# Altium project PCB_Project1.PrjPCB
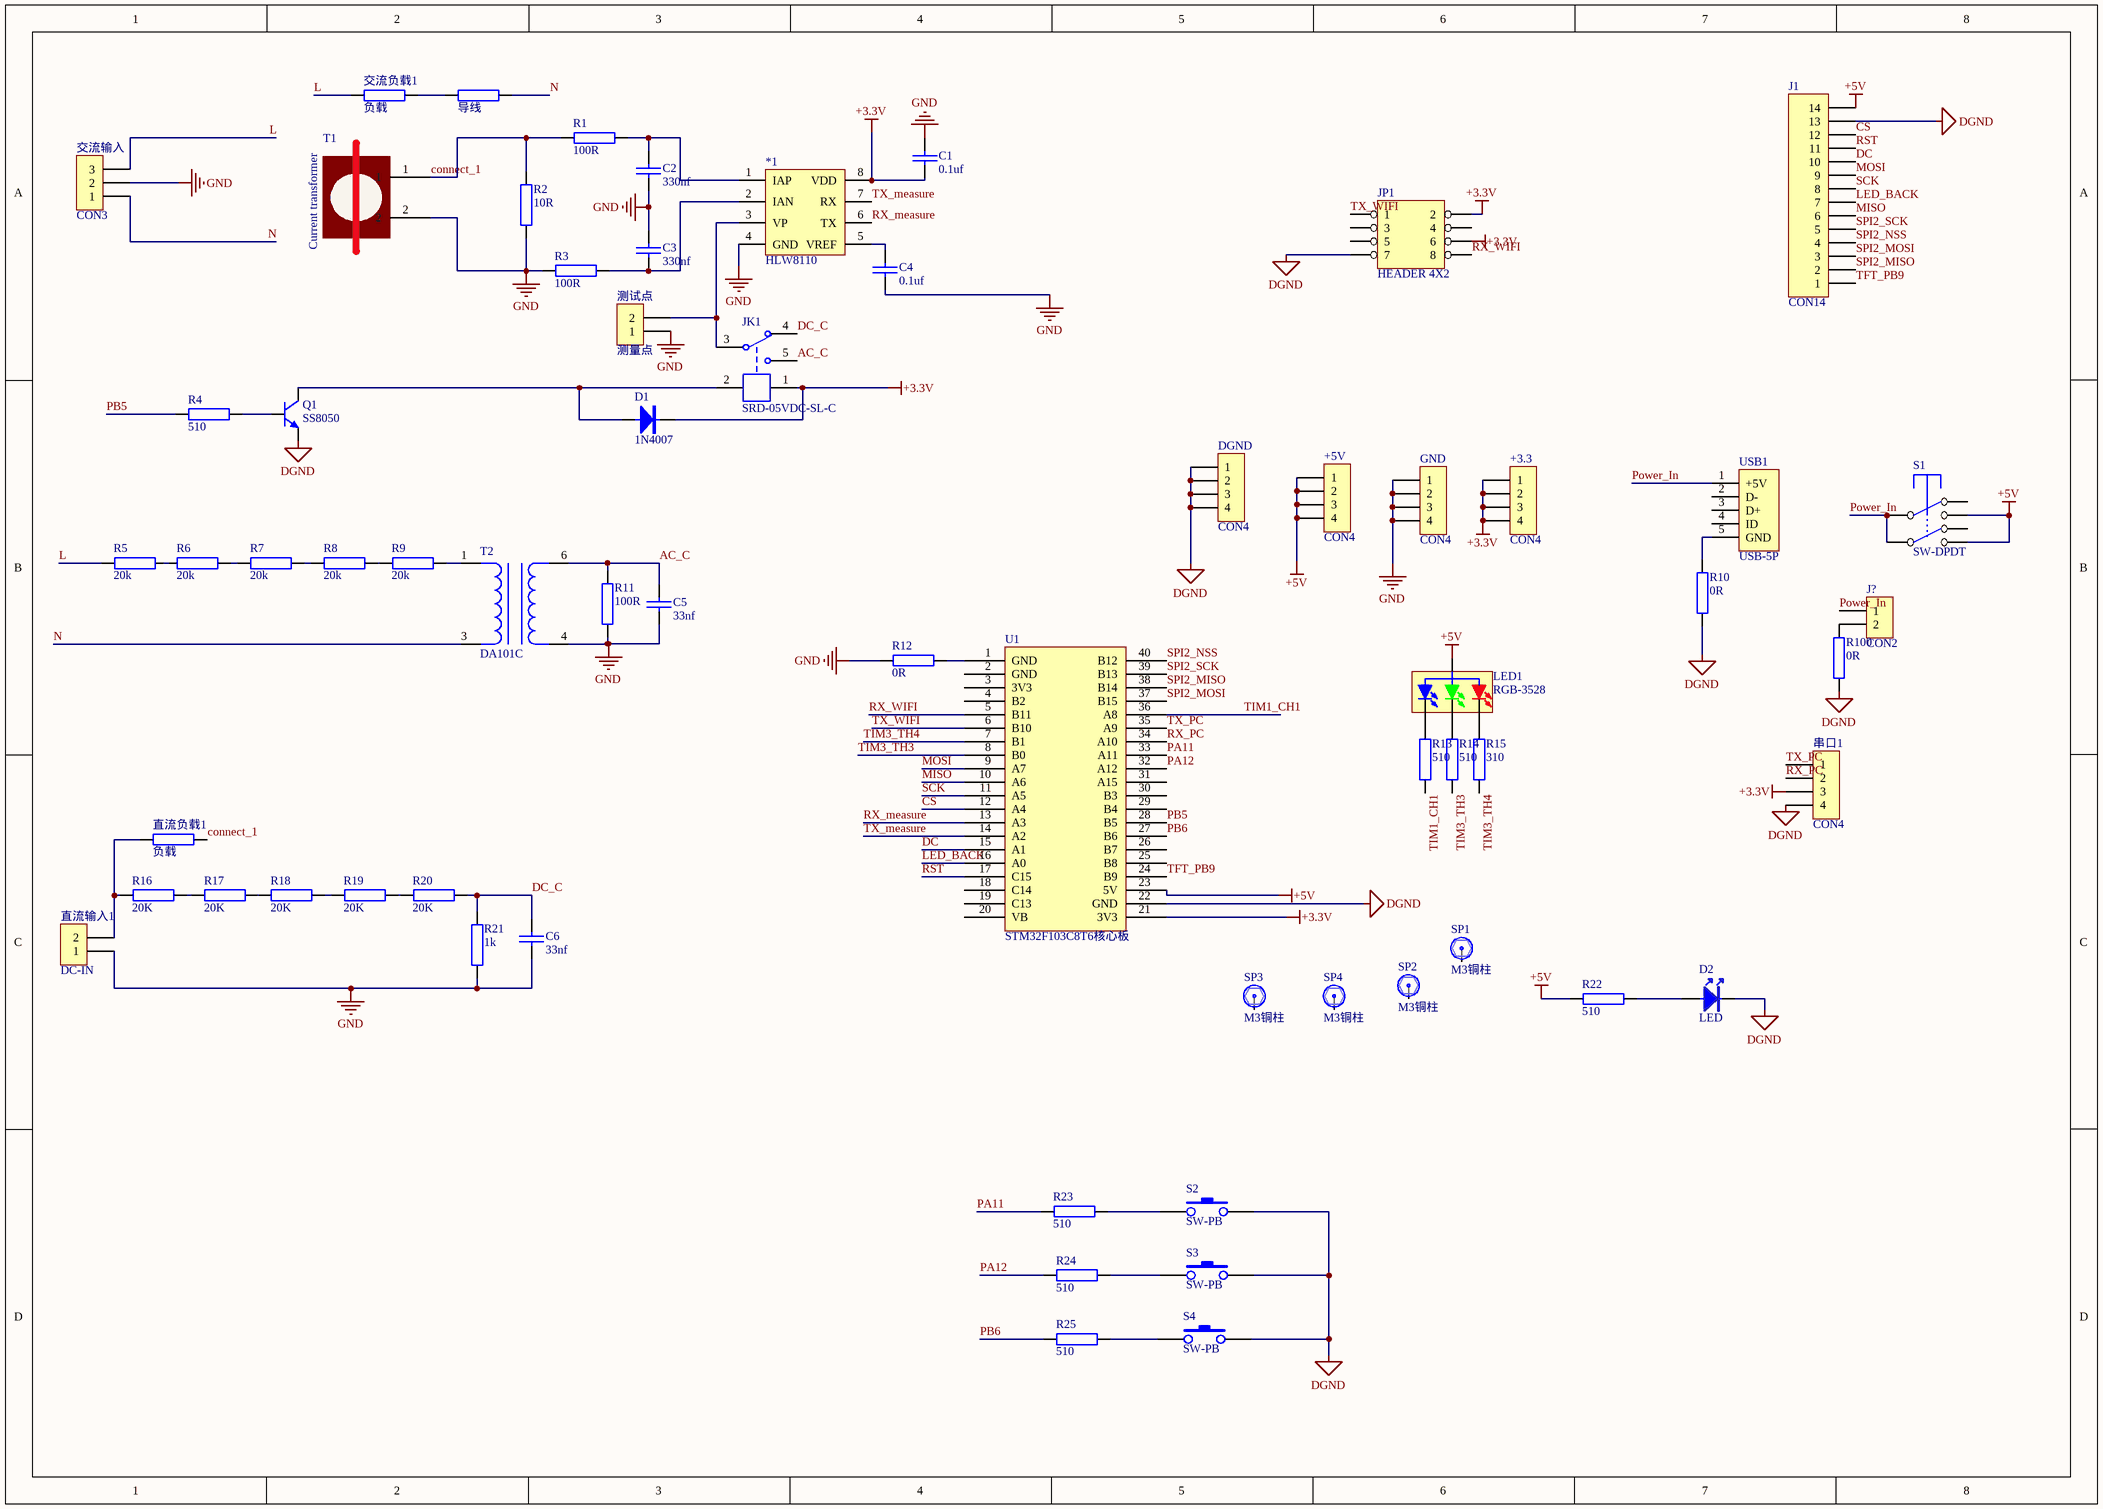
[diagram p0: Sheet1.SchDoc]
1 sheet, 64 parts. Net scope: global (net labels, ports and power ports of the same name join across sheets).
Board file: PCB1.PcbDoc

## Sheet Sheet1.SchDoc
size A3

### Parts
1  导线  [KF2EDGK5.0-LI-2P]
*1  HLW8110  [SOP8W_M]
+3.3  CON4  [sip-4]
+5V  CON4  [sip-4]
C1  0.1uf  [0603]
C2  330nf  [0603]
C3  330nf  [0603]
C4  0.1uf  [0603]
C5  33nf  [0603]
C6  33nf  [0603]
D1  1N4007  [LED_0805]
D2  LED  [LED_0805]
DGND  CON4  [sip-4]
GND  CON4  [sip-4]
J1  CON14  [2.8_LCD]
J?  CON2  [KF2EDGK5.0-LI-2P]
JK1  SRD-05VDC-SL-C  [SRD-C_B]
JP1  HEADER 4X2  [IDC-8]
LED1  RGB-3528  [LED 3528-4Pin]
Q1  SS8050  [TO92A]
R1  100R  [0805]
R2  10R  [0805]
R3  100R  [0805]
R4  510  [0805]
R5  20k  [0805]
R6  20k  [0805]
R7  20k  [0805]
R8  20k  [0805]
R9  20k  [0805]
R10  0R  [0805]
R11  100R  [0805]
R12  0R  [0805]
R13  510  [0805]
R14  510  [0805]
R15  310  [0805]
R16  20K  [0805]
R17  20K  [0805]
R18  20K  [0805]
R19  20K  [0805]
R20  20K  [0805]
R21  1k  [0805]
R22  510  [0805]
R23  510  [0805]
R24  510  [0805]
R25  510  [0805]
R100  0R  [0805]
S1  SW-DPDT  [SWH7*7]
S2  SW-PB  [SW6*6]
S3  SW-PB  [SW6*6]
S4  SW-PB  [SW6*6]
SP1  M3铜柱  [M3x4+6_N]
SP2  M3铜柱  [M3x4+6_N]
SP3  M3铜柱  [M3x4+6_N]
SP4  M3铜柱  [M3x4+6_N]
T1  Current transformer  [ZMCT103E]
T2  DA101C  [ZMPT101B]
U1  STM32F103C8T6核心板  [STM32F103C8T6核心板]
USB1  USB-5P  [USB-MICRO_A]
串口1  CON4  [sip-4]
交流负载1  负载  [KF2EDGK5.0-LI-2P]
交流输入  CON3  [KF2EDGK5.0-LI-3P]
测试点  测量点  [sip-2]
直流负载1  负载  [KF2EDGK5.0-LI-2P]
直流输入1  DC-IN  [KF2EDGK5.0-LI-2P]

### Nets
+3.3V: *1.8(VDD) +3.3.1 +3.3.2 +3.3.3 +3.3.4 C1.2 D1.2 JK1.1 JP1.2 JP1.6 U1.21(3V3) 串口1.3
+5V: +5V.1 +5V.2 +5V.3 +5V.4 J1.14 LED1.4(A) R22.1 S1.3 S1.4 U1.23(5V)
DGND: D2.2 DGND.1 DGND.2 DGND.3 DGND.4 J1.13 JP1.7 Q1.1(E) R10.1 R100.1 S2.2 S3.2 S4.2 U1.22(GND) 串口1.4
GND: *1.4(GND) C1.1 C2.2 C3.1 C4.2 C5.2 C6.2 GND.1 GND.2 GND.3 GND.4 R2.1 R3.1 R11.1 R12.1 R21.1 T1.2 T2.4 交流输入.2 测试点.1 直流输入1.1
AC_C: C5.1 JK1.5 R11.2 T2.6
connect_1: R1.1 R2.2 T1.1 直流负载1.2
CS: J1.12 U1.12(A4)
DC: J1.10 U1.15(A1)
DC_C: C6.1 JK1.4 R20.2 R21.2
L: R5.1 交流负载1.1 交流输入.3
LED_BACK: J1.7 U1.16(A0)
MISO: J1.6 U1.10(A6)
MOSI: J1.9 U1.9(A7)
N: 1.2 T2.3 交流输入.1
PA11: R23.1 U1.33(A11)
PA12: R24.1 U1.32(A12)
PB5: R4.1 U1.28(B5)
PB6: R25.1 U1.27(B6)
Power_In: J?.1 S1.2 S1.5 USB1.1(+5V)
RST: J1.11 U1.17(C15)
RX_measure: *1.6(TX) U1.13(A3)
RX_PC: U1.34(A10) 串口1.2
RX_WIFI: JP1.8 U1.5(B11)
SCK: J1.8 U1.11(A5)
SPI2_MISO: J1.2 U1.38(B14)
SPI2_MOSI: J1.3 U1.37(B15)
SPI2_NSS: J1.4 U1.40(B12)
SPI2_SCK: J1.5 U1.39(B13)
TFT_PB9: J1.1 U1.24(B9)
TIM1_CH1: R13.1 U1.36(A8)
TIM3_TH3: R14.1 U1.8(B0)
TIM3_TH4: R15.1 U1.7(B1)
TX_measure: *1.7(RX) U1.14(A2)
TX_PC: U1.35(A9) 串口1.1
TX_WIFI: JP1.1 U1.6(B10)
Net1_1: 1.1 交流负载1.2
Net*1_1: *1.1(IAP) C2.1 R1.2
Net*1_2: *1.2(IAN) C3.2 R3.2
Net*1_3: *1.3(VP) JK1.3 测试点.2
Net*1_5: *1.5(VREF) C4.1
NetD1_1: D1.1 JK1.2 Q1.3(C)
NetD2_1: D2.1 R22.2
NetJ?_2: J?.2 R100.2
NetLED1_1: LED1.1(RED_K) R15.2
NetLED1_2: LED1.2(GREEN_K) R14.2
NetLED1_3: LED1.3(BULE_K) R13.2
NetQ1_2: Q1.2(B) R4.2
NetR5_2: R5.2 R6.1
NetR6_2: R6.2 R7.1
NetR7_2: R7.2 R8.1
NetR8_2: R8.2 R9.1
NetR9_2: R9.2 T2.1
NetR10_2: R10.2 USB1.5(GND)
NetR12_2: R12.2 U1.1(GND)
NetR16_1: R16.1 直流负载1.1 直流输入1.2
NetR16_2: R16.2 R17.1
NetR17_2: R17.2 R18.1
NetR18_2: R18.2 R19.1
NetR19_2: R19.2 R20.1
NetR23_2: R23.2 S2.1
NetR24_2: R24.2 S3.1
NetR25_2: R25.2 S4.1

Not connected (* = marked no-connect by the designer): JP1 3 4 5; S1 1 6; SP1 1; SP2 1; SP3 1; SP4 1; U1 2(GND) 3(3V3) 4(B2) 18(C14) 19(C13) 20(VB) 25(B8) 26(B7) 29(B4) 30(B3) 31(A15); USB1 2(D-) 3(D+) 4(ID)

### Library data of the parts
1 R1-R25 R100 交流负载1 直流负载1 = RES: 电阻
+3.3 +5V DGND GND 串口1 = CON4: Connector
C1-C6 = CAP1
D1 = DIODE
J1 = CON14: Connector
J? 测试点 直流输入1 = CON2: Connector
JK1 = SRD-05VDC-SL-C: 5V一组转换; BOM名称: 5V继电器; 版权归属: 源创客; 学习资源: www.ooocke.com
LED1 = LED-RGB 3528: 3528三基色LED; BOM名称: 三基色LED; 版权归属: 封装库来自淘宝 ID：黄晶宝石; 学习资源: https://shop463601444.taobao.com
Q1 = 8050-DIP: 高频放大-NPN型; 版权归属: 封装库来自淘宝 ID：黄晶宝石; 属性: 40V 1.5A 1W 100MHZ; BOM名称: 高频放大-NPN型; 学习资源: https://shop463601444.taobao.com
SP1-SP4 = 铜柱加头大焊盘: 铜柱; 版权归属: 封装库来自淘宝 ID：黄晶宝石; BOM名称: 铜柱; 学习资源: https://shop463601444.taobao.com
T2 = DA10XC: 数字隔离变压器; pin to pad: 3>2 6>3; 版权归属: 源创客; ROM名称: 数字隔离变压器; 学习资源: www.ooocke.com
USB1 = USB-5P: 微型USB母座; BOM名称: 微型USB母座; 学习资源: https://shop463601444.taobao.com
交流输入 = CON3: Connector